# Altium schematic sheet micro.SchDoc
size A4; SheetNumber: 2; SheetTotal: 3; SPICEModelCacheMVBHQZXF: <root> / <DocumentId>MVBHQZXF</DocumentId> / <CacheFrame Number="0"> / <Model Name="2n3904" Kind="MDL"> / <Text>*2N3904 / *Si 310mW  40V 200mA 300MHz pkg:TO-92B 1,2,3 / .MODEL 2N3904 NPN(IS=1.4E-14 BF=300 VAF=100 IKF=0.025 ISE=3E-13 / + BR=7.5 RC=2.4 CJE=4.5E-12 TF=4E-10 CJC=3.5E-12 TR=2.1E-8 XTB=1.5 KF=9E-16 )</Text> / </Model> / <Model Name="led0" Kind="MDL"> / <Text>*Typ INFRARED GaAs LED: Vf=1.2V Vr=5V If=40mA trr=3uS / *LED Pinout: 1=A, 2=K / .MODEL LED0 D (IS=93.5P RS=84M N=2.63 BV=5 IBV=10U / + CJO=2.97P VJ=.75 M=.333 TT=4.32U)</Text> / </Model> / </CacheFrame> / </root>
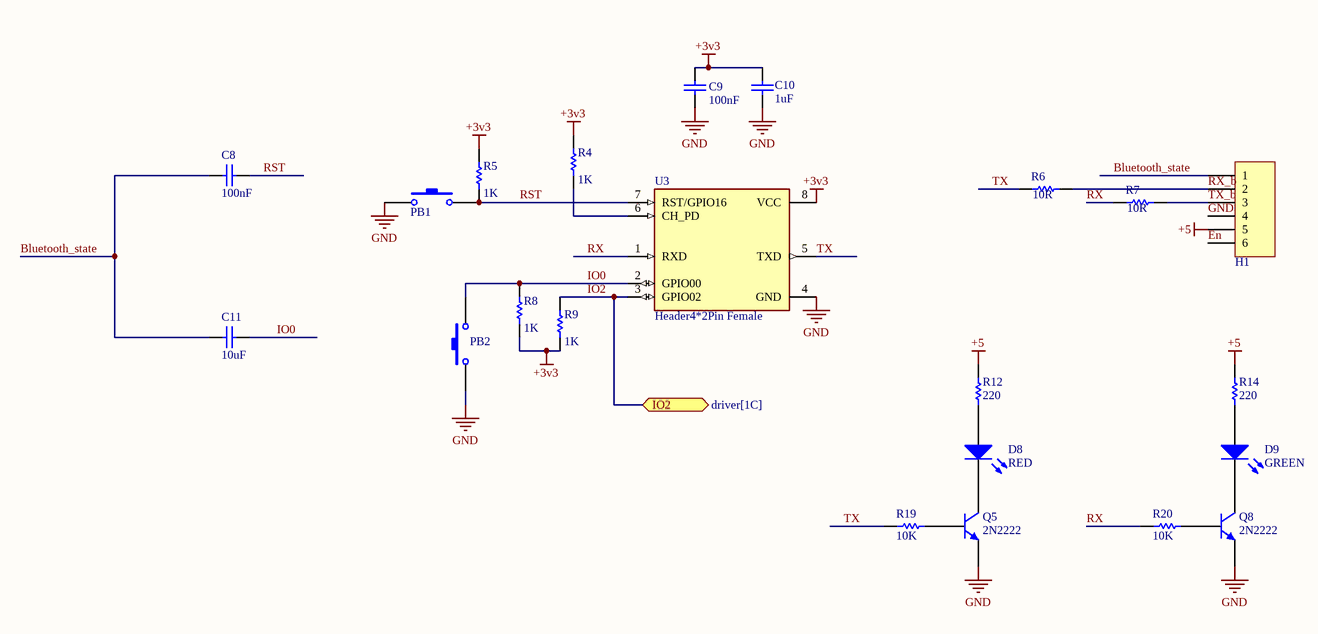
[diagram p0: micro.SchDoc]

## Parts
C8  value 100nF  [CAP0805]  (hidden comment: cap 100nF)
C9  value 100nF  [CAP0805]  (hidden comment: cap 100nF)
C10  value 1uF  [CAP0805]  (hidden comment: cap 1uF)
C11  value 10uF  [CAP0805]  (hidden comment: cap 10uF)
D8  RED  [LED_0603 R]
D9  GREEN  [LED_0603 G]
H1  H-1x6  [H-1x6]  (value not drawn)
PB1  Push-Button-tall  [tack-sw-3x5x6]  (value not drawn)
PB2  Push-Button-tall  [tack-sw-3x5x6]  (value not drawn)
Q5  2N2222  [SOT23_BEC_L]
Q8  2N2222  [SOT23_BEC_L]
R4  value 1K  [RES0805]  (hidden comment: Res 1K)
R5  value 1K  [RES0805]  (hidden comment: Res 1K)
R6  value 10R  [RES0805]  (hidden comment: Res 10R)
R7  value 10R  [RES0805]  (hidden comment: Res 10R)
R8  value 1K  [RES0805]  (hidden comment: Res 1K)
R9  value 1K  [RES0805]  (hidden comment: Res 1K)
R12  value 220  [RES0805]  (hidden comment: Res 220)
R14  value 220  [RES0805]  (hidden comment: Res 220)
R19  value 10K  [RES0805]  (hidden comment: Res 10K)
R20  value 10K  [RES0805]  (hidden comment: Res 10K)
U3  Header4*2Pin Female  [ESP8266-01/ESP-01]

## Ports
IO2 (bidir, see driver[1C])

## Nets
+3v3: C9.2 C10.1 R4.1 R5.1 R8.2 R9.2 U3.8(VCC)
+5: H1.5 R12.2 R14.2
GND: C9.1 C10.2 H1.4 PB1.1 PB2.1 Q5.1(E) Q8.1(E) U3.4(GND)
Bluetooth_state: C8.2 C11.2 H1.1
En: H1.6
IO0: C11.1 PB2.2 R8.1 U3.2(GPIO00)
IO2: R9.1 U3.3(GPIO02) ; port IO2
RST: C8.1 PB1.2 R5.2 U3.7(RST/GPIO16)
RX: R7.2 R20.1 U3.1(RXD)
RX_b: H1.2 R6.2
TX: R6.1 R19.1 U3.5(TXD)
TX_b: H1.3 R7.1
NetD8_1: D8.1(A) R12.1
NetD8_2: D8.2(K) Q5.3(C)
NetD9_1: D9.1(A) R14.1
NetD9_2: D9.2(K) Q8.3(C)
NetQ5_2: Q5.2(B) R19.2
NetQ8_2: Q8.2(B) R20.2
NetR4_2: R4.2 U3.6(CH_PD)

## Library data of the parts
C8-C11 = Cap ceramic: CAP seramic
D8 D9 = LED0: Typical INFRARED GaAs LED; Published: 8-Jun-2000; LatestRevisionDate: 08-Jul-2005; LatestRevisionNote: Mech Layer 1 removed.; PackageReference: LED-0; Publisher: Altium Limited; PackageDescription: LED; 2 Leads
H1 = H-1x6: Bluetooth module HC05
Q5 Q8 = 2N3904: NPN General Purpose Amplifier; pin to pad: 1>2 2>1; Published: 8-Jun-2000; LatestRevisionDate: 15-Jan-2003; LatestRevisionNote: PCB Footprint 'BCY-W3/D4.7' replaced; DatasheetVersion: 1997; PackageVersion: Sep-1998; PackageReference: TO-92A; Publisher: Altium Limited; PackageDescription: TO, Flat Index; 3 In-Line, Axial Leads; Body Dia. 4.5mm; Leads 0.51 x 0.48 mm (max); ComponentLink1Description: Manufacturer Link; ComponentLink1URL: http://www.fairchildsemi.com/; ComponentLink2Description: Datasheet; ComponentLink2URL: http://www.fairchildsemi.com/ds/2N%2F2N3904.pdf
R4-R9 R12 R14 R19 R20 = Res1: Resistor; Published: 8-Jun-2000; LatestRevisionDate: 17-Jul-2002; LatestRevisionNote: Re-released for DXP Platform.; PackageReference: AXIAL-0.3; Publisher: Altium Limited; PackageDescription: Axial Device, Thru-Hole; 2 Leads; 0.3 in Pin Spacing
U3 = ESP8266-01/ESP-01: ESP-01 wifi module; MF: AI-Thinker; Package: None; Availability: Unavailable; MP: ESP8266-01/ESP-01; Value: *; SnapEDA_Link: https://www.snapeda.com/parts/ESP8266-01/ESP-01/AI-Thinker/view-part/106413/?ref=snap; Price: None